# Altium project MedBox.PrjPcb
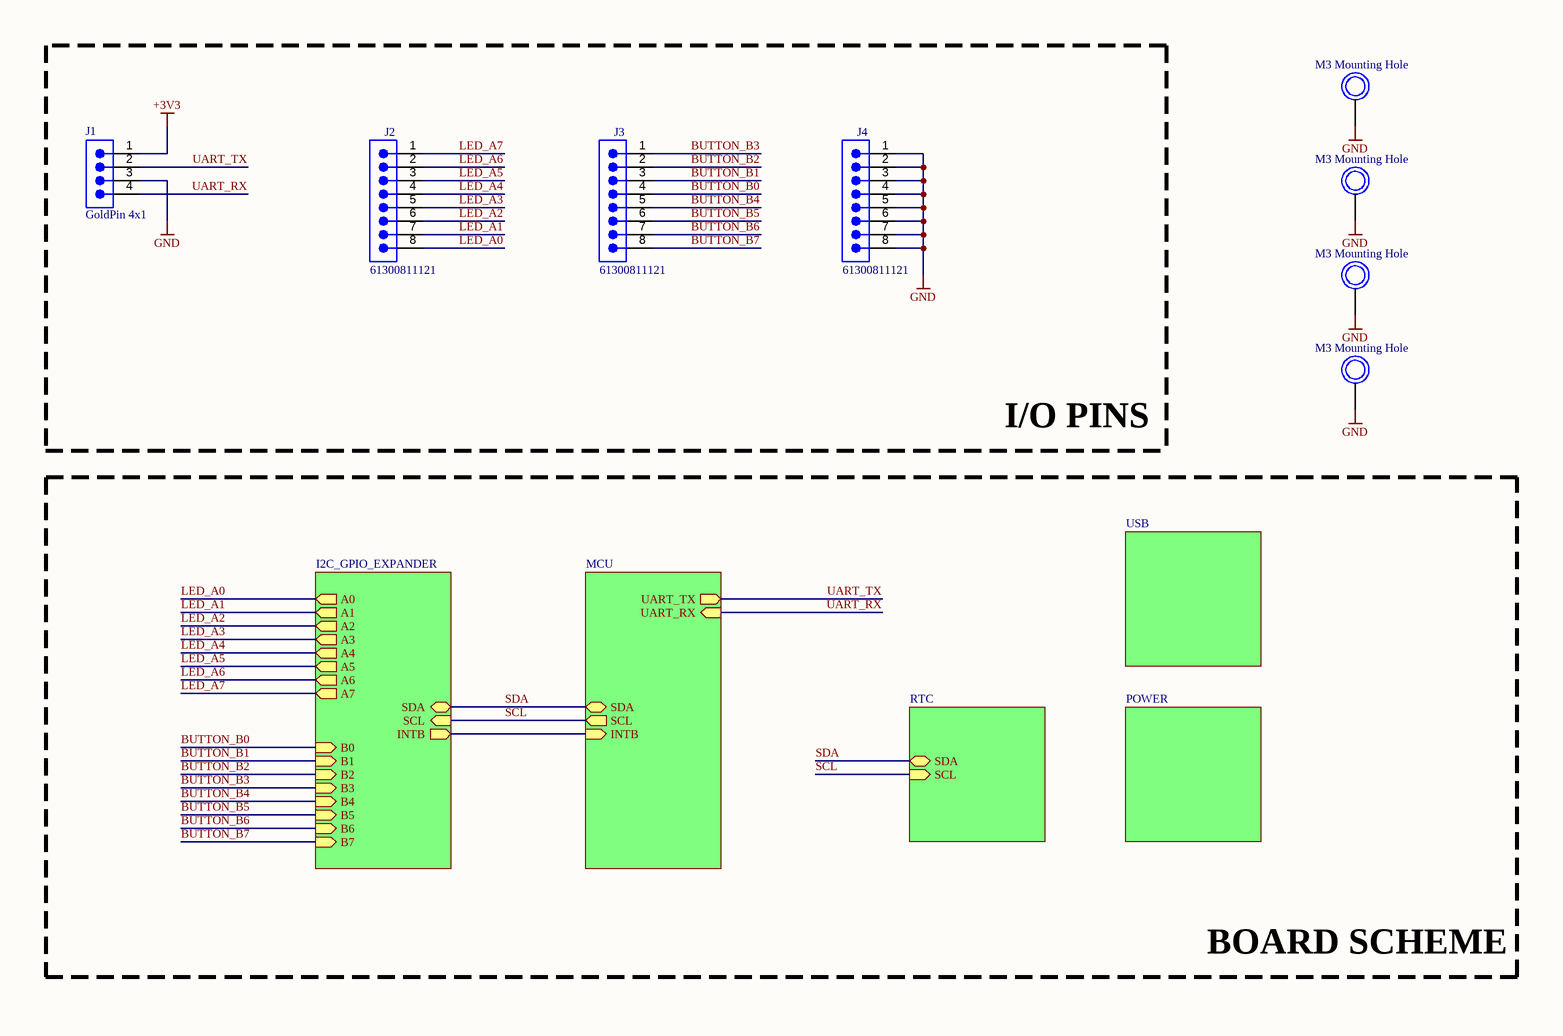
[diagram p0: MED_BOX.SchDoc]
6 sheets, 54 parts. Net scope: hierarchical (ports join the sheet entries above them; power ports are global).
Board files: MED_BOX.PcbDoc, MED_BOX_v0.2.PcbDoc
Sheets:
  MED_BOX.SchDoc
    Designator = MCU.SchDoc
    Designator = I2C_GPIO_EXPANDER.SchDoc
    Designator = POWER.SchDoc
    USB = USB.SchDoc
    RTC = RTC.SchDoc

## Sheet MED_BOX.SchDoc
size A4; SheetNumber: 1; SheetTotal: 6

### Parts
J1  GoldPin 4x1  [SMTC-TSW-104-08-X-S]
J2  61300811121  [61300811121]
J3  61300811121  [61300811121]
J4  61300811121  [61300811121]
MH1  M3 Mounting Hole  [Copy of M4 Mounting Hole]
MH2  M3 Mounting Hole  [Copy of M4 Mounting Hole]
MH3  M3 Mounting Hole  [Copy of M4 Mounting Hole]
MH4  M3 Mounting Hole  [Copy of M4 Mounting Hole]

### Blocks framed on the sheet
I/O PINS: J1-J4

### Sub-sheets
Designator = MCU: SDA (bidir), SCL (out), INTB (in), UART_TX (out), UART_RX (in)
Designator = I2C_GPIO_EXPANDER: A0 (out), A1 (out), A2 (out), A3 (out), A4 (out), A5 (out), A6 (out), A7 (out), B0 (in), B1 (in), B2 (in), B3 (in), B4 (in), B5 (in), B6 (in), B7 (in), SCL (in), SDA (bidir), INTB (out)
Designator = POWER: no entries
RTC = RTC: SDA (bidir), SCL (in)
USB = USB: no entries

### Nets
+3V3: J1.1  [project net VCC]
GND: J1.3 J4.1 J4.2 J4.3 J4.4 J4.5 J4.6 J4.7 J4.8 MH1.1 MH2.1 MH3.1 MH4.1
BUTTON_B0: J3.4 ; sheet Designator/B0
BUTTON_B1: J3.3 ; sheet Designator/B1
BUTTON_B2: J3.2 ; sheet Designator/B2
BUTTON_B3: J3.1 ; sheet Designator/B3
BUTTON_B4: J3.5 ; sheet Designator/B4
BUTTON_B5: J3.6 ; sheet Designator/B5
BUTTON_B6: J3.7 ; sheet Designator/B6
BUTTON_B7: J3.8 ; sheet Designator/B7
LED_A0: J2.8 ; sheet Designator/A0
LED_A1: J2.7 ; sheet Designator/A1
LED_A2: J2.6 ; sheet Designator/A2
LED_A3: J2.5 ; sheet Designator/A3
LED_A4: J2.4 ; sheet Designator/A4
LED_A5: J2.3 ; sheet Designator/A5
LED_A6: J2.2 ; sheet Designator/A6
LED_A7: J2.1 ; sheet Designator/A7
SCL: sheet Designator/SCL, sheet Designator/SCL, sheet RTC/SCL
SDA: sheet Designator/SDA, sheet Designator/SDA, sheet RTC/SDA
UART_RX: J1.4 ; sheet Designator/UART_RX
UART_TX: J1.2 ; sheet Designator/UART_TX
NetU1_20: sheet Designator/INTB, sheet Designator/INTB

### Notes on the sheet
- BOARD SCHEME
- DWG. NO.
- REV.
- SHT.
- REVISION
- DESCRIPTION
- DATE
- APPROVED
- THIS DOCUMENT AND THE DATA DISCLOSED HEREIN OR HEREWITH IS THE PROPERTY OF ALTIUM LIMITED AND MAY BE FREELY DISTRIBUTED IN WHOLE. NO RIGHTS ARE RESERVED OR EXPRESS OR IMPLIED WARANTEE GIVEN.
- ENG:
- DSN:
- APPROVALS
- PROJECT
- DOCUMENT REVISION:
- DESIGN ITEM:
- CHK:
- BOM:
- REFERENCE DOCUMENTS
- PROJECT REVISION:
- TITLE
- FAB DWG:
- PCB DWG:
- ASSY DWG:
- SCALE:
- SIZE
- D
- CAGE CODE
- FILE NAME
- DWG NO.
- SHEET
- OF
- REV

### Library data of the parts
J1 = CMP-00067-4: TSW - Samtec 2.54mm Pin Header 13.46mm Overall Pin Length 5.08mm Tail (08) (mcv)(TO22); Manufacturer: Molex
J2-J4 = CMP-1502-01076-4: THT Vertical Pin Header WR-PHD, Pitch 2.54 mm, Single Row, 8 pins; Pitch: 2.54mm; Voltage Rating: 250V; Connector Type: Male Pin; Current Rating: 3A; Contact Resistance: 20mΩ; Number of Positions: 8; Gender: Male; Contact Mating Length: 5.9944mm; Orientation: Vertical; Contact Plating: Gold; Mount: Through Hole; Min Operating Temperature: -40°C; Packaging: Bulk; Height: 8.54mm; Number of Pins: 8; Contact Material: Gold; Operating Supply Voltage: 250V; Termination: Solder; RoHS: Compliant; Color: Black; Number of Contacts: 8; Lead Pitch: 2.54mm; Number of Rows: 1; Max Operating Temperature: 105°C
MH1-MH4 = CONN-00002-1: Manufacturer: Molex

## Sheet MCU.SchDoc
size A4; SheetNumber: 5; SheetTotal: 6
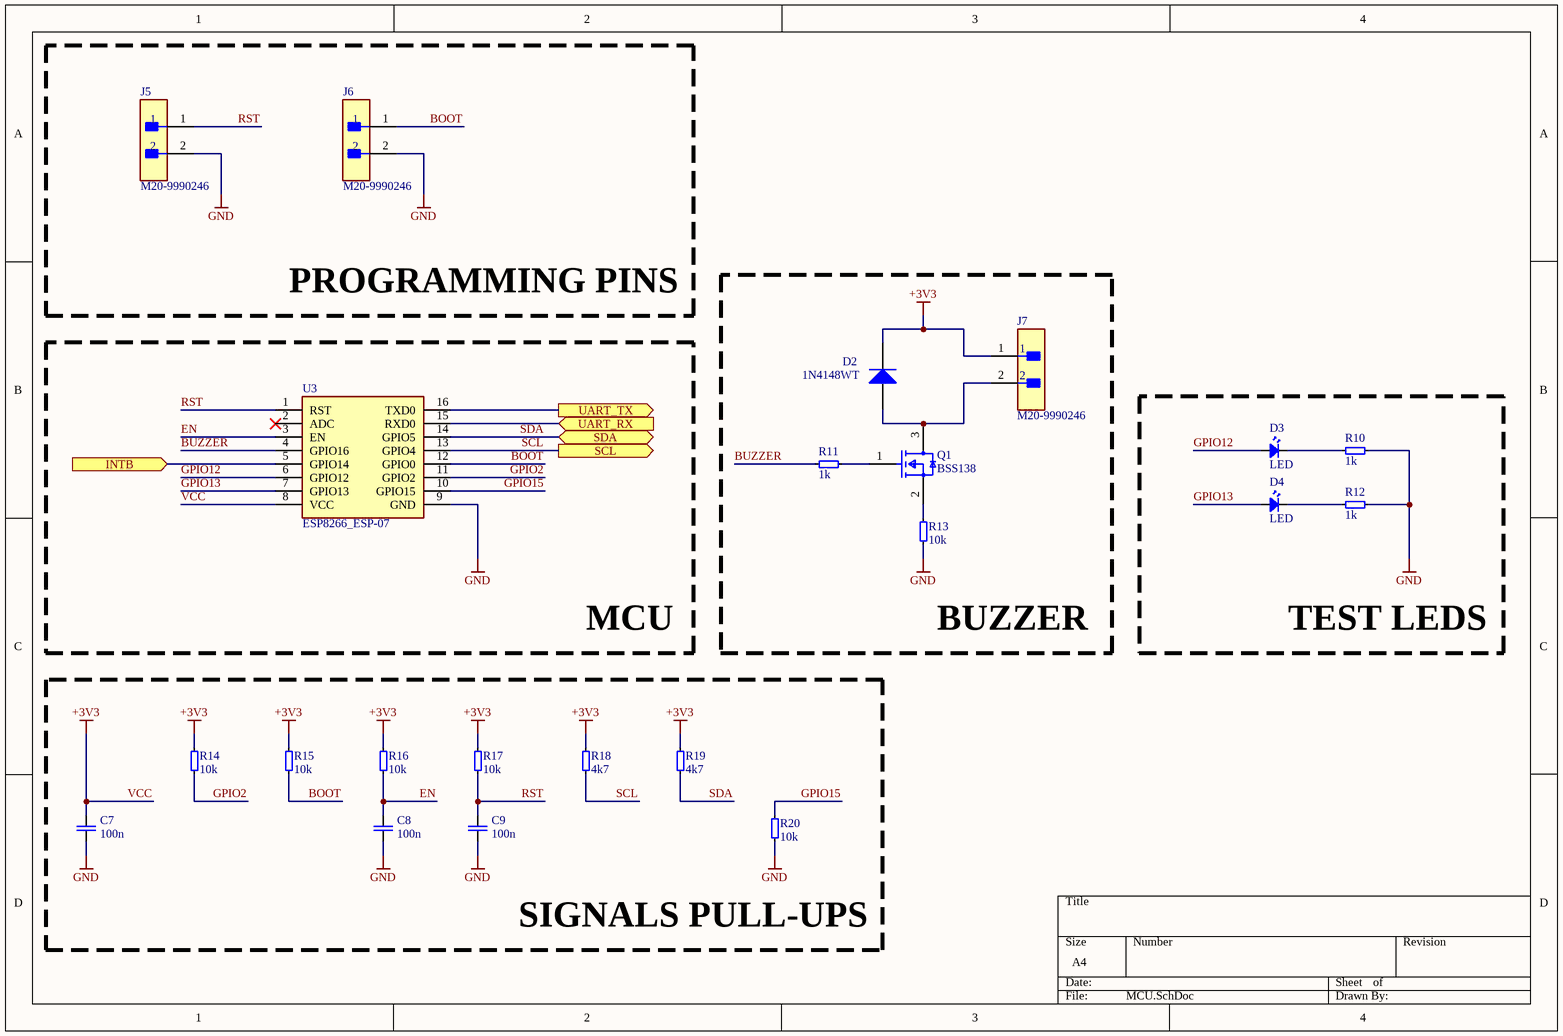
[diagram p1: MCU.SchDoc]

### Parts
C7  100n  [C0603]
C8  100n  [C0603]
C9  100n  [C0603]
D2  1N4148WT  [FAIR-SOD-523F-2_V]
D3  LED  [LED0603]
D4  LED  [LED0603]
J5  M20-9990246  [FP-M20-9990246-MFG]
J6  M20-9990246  [FP-M20-9990246-MFG]
J7  M20-9990246  [FP-M20-9990246-MFG]
Q1  BSS138  [FP-318-08-IPC_B]
R10  1k  [R0603]
R11  1k  [R0603]
R12  1k  [R0603]
R13  10k  [R0603]
R14  10k  [R0603]
R15  10k  [R0603]
R16  10k  [R0603]
R17  10k  [R0603]
R18  4k7  [R0603]
R19  4k7  [R0603]
R20  10k  [R0603]
U3  ESP8266_ESP-07  [ESP8266ESP07]

### Blocks framed on the sheet
PROGRAMMING PINS: J5 J6
BUZZER: D2 J7 Q1 R11 R13
MCU: U3
TEST LEDS: D3 D4 R10 R12
SIGNALS PULL-UPS: C7-C9 R14-R20

### Ports
INTB (in, see MED_BOX[3B], I2C_GPIO_EXPANDER[1A]), SCL (out, see MED_BOX[3B], I2C_GPIO_EXPANDER[1B], RTC[1A]), SDA (bidir, see MED_BOX[3B], I2C_GPIO_EXPANDER[1B], RTC[1A]), UART_RX (in, see MED_BOX[2B]), UART_TX (out, see MED_BOX[2B])

### Nets
GND: C7.1 C8.1 C9.1 J5.2 J6.2 R10.2 R12.2 R13.1 R20.1 U3.9(GND)
VCC: C7.2 D2.1(K) J7.1 R14.2 R15.2 R16.2 R17.2 R18.2 R19.2 U3.8(VCC)  [also labelled +3V3]
BOOT: J6.1 R15.1 U3.12(GPIO0)
BUZZER: R11.2 U3.4(GPIO16)
EN: C8.2 R16.1 U3.3(EN)
GPIO2: R14.1 U3.11(GPIO2)
GPIO12: D3.A U3.6(GPIO12)
GPIO13: D4.A U3.7(GPIO13)
GPIO15: R20.2 U3.10(GPIO15)
RST: C9.2 J5.1 R17.1 U3.1(RST)
SCL: R18.1 U3.13(GPIO4) ; port SCL
SDA: R19.1 U3.14(GPIO5) ; port SDA
UART_RX: U3.15(RXD0) ; port UART_RX
UART_TX: U3.16(TXD0) ; port UART_TX
NetD2_2: D2.2(A) J7.2 Q1.3(D)
NetD3_K: D3.K R10.1
NetD4_K: D4.K R12.1
NetQ1_1: Q1.1(G) R11.1
NetQ1_2: Q1.2(S) R13.2
NetU1_20: U3.5(GPIO14) ; port INTB

Not connected (* = marked no-connect by the designer): U3 2(ADC)*

### Library data of the parts
C7-C9 = CMP-00024-8: Generic 0603 SMD Ceramic Capacitor
D2 = CMP-0881-00001-1: High Conductance Fast Switching Diode, 75 V, -55 to 150 degC, 2-Pin SOD523F, RoHS; Manufacturer: Fairchild Semiconductor; IR (VR: 75 V)=5 uA Max.; VF: 1 V Max.; BVR (IR: 5 uA)=75 V Min.; CO: 4 pF Max.; DatasheetVersion: Rev. A2; ComponentLink1Description: Manufacturer URL; PackageDescription: 2-Pin Surface Mount Device, Body 1.2 x 0.8 mm, Height 0.7 mm; ComponentLink2URL: http://www.fairchildsemi.com/ds/1N/1N4148WT.pdf; ComponentLink2Description: Datasheet; PartNumber: 1N4148WT; ComponentLink1URL: http://www.fairchildsemi.com/; Temperature Range: -55 to 150 degC; Mounting Technology: Surface Mount; PackageReference: SOD-523F-2; RoHS: TRUE
D3 D4 = CMP-00036-7: 0603 LED
J5-J7 = CMP-15831-000009-1: CONN HEADER VERT 2POS 2.54MM; Manufacturer: Harwin; Conn Gender: Male; Conn Orientation: Vertical; Number Of Contacts: 2; Current Rating: 3A; ComponentLink2URL: https://cdn.harwin.com/pdfs/M20-999.pdf; ComponentLink2Description: Datasheet; Package: M20-9990246; Temperature: -40°C to +105°C; Octopart: https://octopart.com/m20-9990246-harwin-2590635; Mouser Description: 2.54mm (0.1") Pitch SIL Vertical PC Tail Pin Header, 6.1mm mating pin height, tin, 2 contacts; Temperature Range High: +105°C; Device Class L1: Connectors; RoHS: TRUE; Automotive: No; Height: 8.99mm; Number Of Rows: 1; Contact Material: Tin,Nickel; Category: Conn; Pitch: 2.54mm; Lead Free: Yes; Digikey Description: CONN HEADER VERT 2POS 2.54MM; Manufacturer Part Number: M20-9990246; Temperature Range Low: -40°C; Device Class L3: unset; Device Class L2: Headers and Wire Housings
Q1 = CMP-07173-000101-1: MOSFET N-CH 50V 220MA SOT-23; Turn-Off Delay Time: 20ns; Element Configuration: Single; Rds On Max: 3.5R; Gate to Source Voltage (Vgs): 20V; Threshold Voltage: 1.3V; Number of Elements: 1; Power Dissipation: 360mW; Rise Time: 9ns; Turn-On Delay Time: 2.5ns; Input Capacitance: 27pF; On-State Resistance: 6R; Lead Free: Lead Free; Length: 2.92mm; Width: 1.3mm; Drain to Source Breakdown Voltage: 50V; Min Operating Temperature: -55°C; REACH SVHC: No SVHC; Packaging: Tape and Reel; Radiation Hardening: No; Height: 0.93mm; Drain to Source Voltage (Vdss): 50V; Current Rating: 220mA; Voltage Rating (DC): 50V; Weight: 0.03g; Continuous Drain Current (ID): 220mA; Number of Pins: 3; Nominal Vgs: 1.3V; Max Power Dissipation: 360mW; Fall Time: 9ns; Drain to Source Resistance: 3.5R; Contact Plating: Tin; Case/Package: SOT-23; Package Quantity: 1; Dual Supply Voltage: 50V; Mount: Surface Mount; Termination: SMD/SMT; Max Operating Temperature: 150°C
R10-R20 = CMP-00017-10: Generic 0603 SMD Resistor
U3 = ESP8266_ESP-07: Connector; Manufacturer_Name: Ai-Thinker; Manufacturer_Part_Number: ESP8266 ESP-07; Datasheet Link: http://datasheet.octopart.com/ESP-07S-RF-Solutions-datasheet-104506015.pdf; Height: 3mm

## Sheet I2C_GPIO_EXPANDER.SchDoc
size A4; SheetNumber: 2; SheetTotal: 6
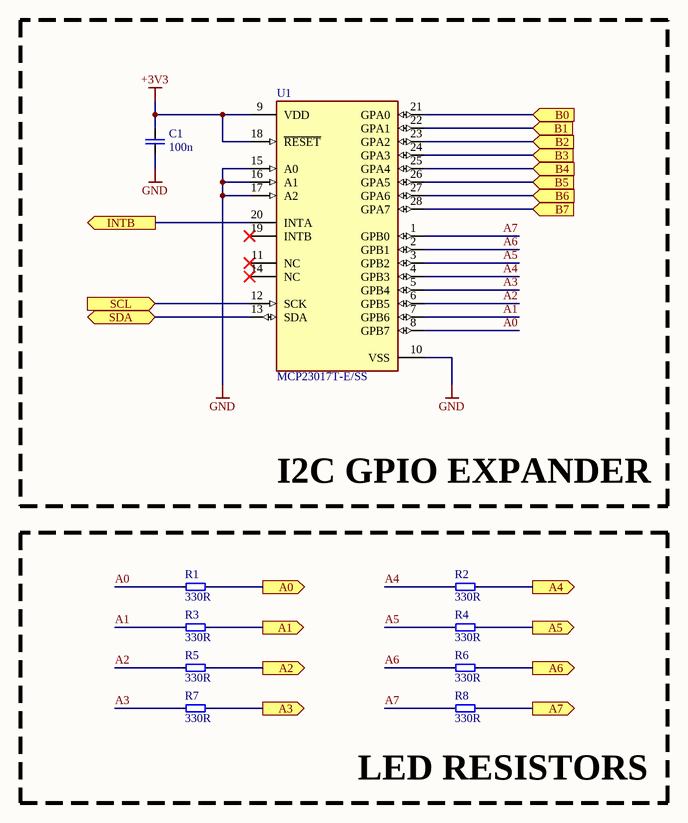
[diagram p2: I2C_GPIO_EXPANDER.SchDoc]

### Parts
C1  100n  [C0603]
R1  330R  [R0603]
R2  330R  [R0603]
R3  330R  [R0603]
R4  330R  [R0603]
R5  330R  [R0603]
R6  330R  [R0603]
R7  330R  [R0603]
R8  330R  [R0603]
U1  MCP23017T-E/SS  [FP-C04-073-IPC_C]

### Blocks framed on the sheet
I2C GPIO EXPANDER: C1 U1
LED RESISTORS: R1-R8

### Ports
A0 (out, see MED_BOX[3B]), A1 (out, see MED_BOX[3B]), A2 (out, see MED_BOX[3B]), A3 (out, see MED_BOX[3B]), A4 (out, see MED_BOX[3B]), A5 (out, see MED_BOX[3B]), A6 (out, see MED_BOX[3B]), A7 (out, see MED_BOX[3B]), B0 (in, see MED_BOX[3B]), B1 (in, see MED_BOX[3B]), B2 (in, see MED_BOX[3B]), B3 (in, see MED_BOX[3A]), B4 (in, see MED_BOX[3A]), B5 (in, see MED_BOX[3A]), B6 (in, see MED_BOX[3A]), B7 (in, see MED_BOX[3A]), INTB (out, see MED_BOX[3B], MCU[1B]), SCL (in, see MED_BOX[3B], MCU[2B], RTC[1A]), SDA (bidir, see MED_BOX[3B], MCU[2B], RTC[1A])

### Nets
+3V3: C1.2 U1.9(VDD) U1.18(~{RESET})  [project net VCC]
GND: C1.1 U1.10(VSS) U1.15(A0) U1.16(A1) U1.17(A2)
A0: R1.1 U1.8(GPB7)
A1: R3.1 U1.7(GPB6)
A2: R5.1 U1.6(GPB5)
A3: R7.1 U1.5(GPB4)
A4: R2.1 U1.4(GPB3)
A5: R4.1 U1.3(GPB2)
A6: R6.1 U1.2(GPB1)
A7: R8.1 U1.1(GPB0)
BUTTON_B0: U1.21(GPA0) ; port B0
BUTTON_B1: U1.22(GPA1) ; port B1
BUTTON_B2: U1.23(GPA2) ; port B2
BUTTON_B3: U1.24(GPA3) ; port B3
BUTTON_B4: U1.25(GPA4) ; port B4
BUTTON_B5: U1.26(GPA5) ; port B5
BUTTON_B6: U1.27(GPA6) ; port B6
BUTTON_B7: U1.28(GPA7) ; port B7
LED_A0: R1.2 ; port A0
LED_A1: R3.2 ; port A1
LED_A2: R5.2 ; port A2
LED_A3: R7.2 ; port A3
LED_A4: R2.2 ; port A4
LED_A5: R4.2 ; port A5
LED_A6: R6.2 ; port A6
LED_A7: R8.2 ; port A7
SCL: U1.12(SCK) ; port SCL
SDA: U1.13(SDA) ; port SDA
NetU1_20: U1.20(INTA) ; port INTB

Not connected (* = marked no-connect by the designer): U1 11(NC)* 14(NC)* 19(INTB)*

### Library data of the parts
C1 = CMP-00024-8: Generic 0603 SMD Ceramic Capacitor
R1-R8 = CMP-00017-10: Generic 0603 SMD Resistor
U1 = CMP-0186-00065-3: IC I/O EXPANDER 16BIT I2C 28SSOP; Number of Channels: 1; Number of Bits: 16; Output Current: 25mA; Nominal Supply Current: 1mA; Operating Supply Voltage: 5.5V; Power Dissipation: 700mW; Max Frequency: 10MHz; Frequency: 1.7MHz; Case/Package: SSOP; Lead Free: Lead Free; Number of Pins: 28; Interface: I2C; Max Operating Temperature: 125°C; Mount: Surface Mount; Number of I/Os: 16; Packaging: Tape and Reel; Min Operating Temperature: -40°C; Package Quantity: 2100

## Sheet POWER.SchDoc
size A4; SheetNumber: 4; SheetTotal: 6
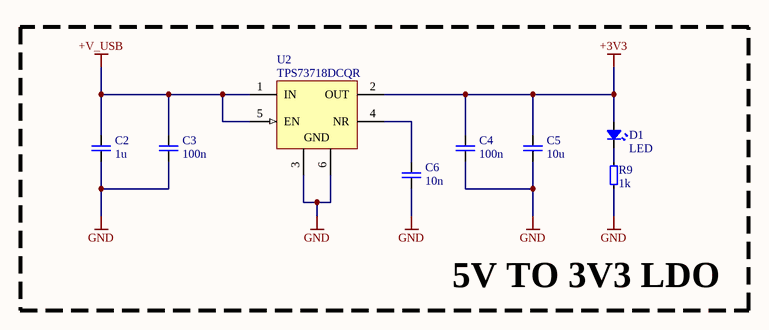
[diagram p3: POWER.SchDoc]

### Parts
C2  1u  [C0603]
C3  100n  [C0603]
C4  100n  [C0603]
C5  10u  [C0805]
C6  10n  [C0603]
D1  LED  [LED0603]
R9  1k  [R0603]
U2  TPS73718DCQR  [DCQ0006A_L]

### Blocks framed on the sheet
5V TO 3V3 LDO: C2-C6 D1 R9 U2

### Nets
+3V3: C4.2 C5.2 D1.A U2.2(OUT)  [project net VCC]
+V_USB: C2.2 C3.2 U2.1(IN) U2.5(EN)
GND: C2.1 C3.1 C4.1 C5.1 C6.1 R9.1 U2.3(GND) U2.6(GND)
NetC6_2: C6.2 U2.4(NR)
NetD1_K: D1.K R9.2

### Library data of the parts
C2-C4 C6 = CMP-00024-8: Generic 0603 SMD Ceramic Capacitor
C5 = CMP-00025-5: Generic 0805 SMD Ceramic Capacitor
D1 = CMP-00036-7: 0603 LED
R9 = CMP-00017-10: Generic 0603 SMD Resistor
U2 = CMP-0395-00291-2: Single Output LDO, 1 A, Fixed 1.8 V Output, 2.2 to 5.5 V Input, with Reverse Current Protection, 6-pin SOT-223 (DCQ), -40 to 125 degC, Green (RoHS & no Sb/Br); Manufacturer: Texas Instruments; Vout Adj(Max)(V): 1.8; Iout(Max)(A): 1; Vin(Max)(V): 5.5; Vdo(Typ)(mV): 130; Rating: Catalog; SubFamily: Single Channel LDO; Vin(Min)(V): 2.2; Accuracy(%): 3; Iq(Typ)(mA): 0.3; DatasheetVersion: SBVS067O; ComponentLink3Description: Package Specification; PackageReference: DCQ0006A; ComponentLink2Description: Datasheet; PackageDescription: 6-Pin Plastic Small Outline, Body 3.5 x 6.5 mm, Pitch 1.27 mm; Mounting Technology: Surface Mount; ComponentLink3URL: http://www.ti.com/litv/pdf/mpds098c; PartNumber: TPS73718DCQR; Fixed Output Options(V): 1.8; ComponentLink1URL: http://www.ti.com/; PackageVersion: 4202109/D; ComponentLink2URL: http://www.ti.com/general/docs/lit/getliterature.tsp?genericPartNumber=TPS73718&fileType=pdf; Eco-Plan: Green (RoHS & no Sb/Br); ComponentLink1Description: Manufacturer URL; Vout Adj(Min)(V): 1.8

## Sheet USB.SchDoc
size A4; SheetNumber: 3; SheetTotal: 6
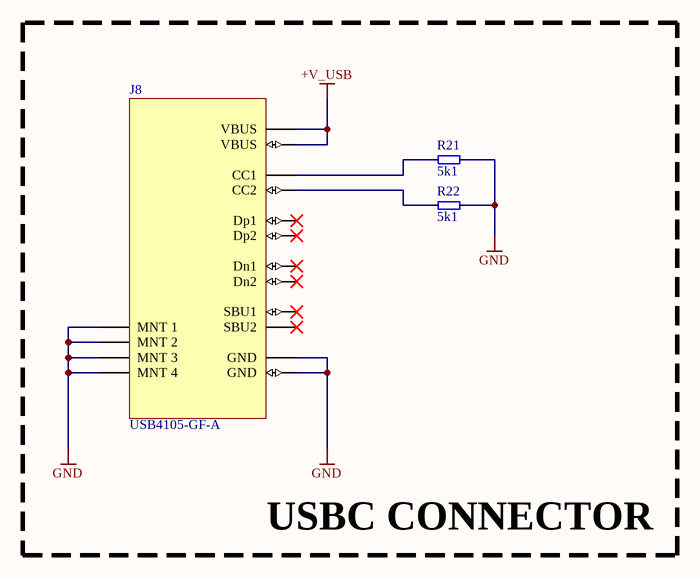
[diagram p4: USB.SchDoc]

### Parts
J8  USB4105-GF-A  [FP-USB4105-GF-A-MFG]
R21  5k1  [R0402]
R22  5k1  [R0402]

### Blocks framed on the sheet
USBC CONNECTOR: J8 R21 R22

### Nets
+V_USB: J8.A4-B9(VBUS) J8.B4-A9(VBUS)
GND: J8.1(MNT_1) J8.2(MNT_2) J8.3(MNT_3) J8.4(MNT_4) J8.A1-B12(GND) J8.B1-A12(GND) R21.2 R22.2
NetJ8_A5: J8.A5(CC1) R21.1
NetJ8_B5: J8.B5(CC2) R22.1

Not connected (* = marked no-connect by the designer): J8 A6(Dp1)* A7(Dn1)* A8(SBU1)* B6(Dp2)* B7(Dn2)* B8(SBU2)*

### Library data of the parts
J8 = CONN-00045-1: USB Connector, 24 Contact(s), Female, Right Angle, Solder Terminal, Locking, Receptacle; Manufacturer: GCT; Supplier: Mouser; Manufacturer PN: USB4105-GF-A; Supplier PN: 640-USB4105-GF-A
R21 R22 = CMP-00016-10: Generic 0402 SMD Resistor

## Sheet RTC.SchDoc
size A4; SheetNumber: 6; SheetTotal: 6
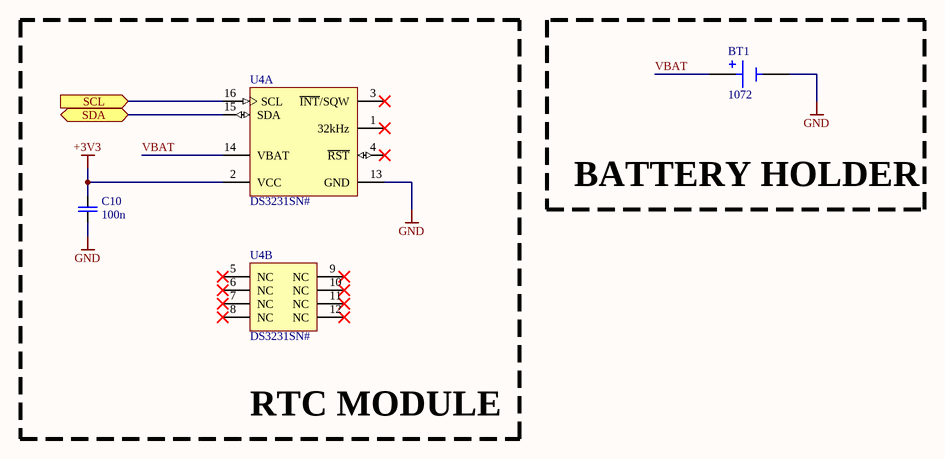
[diagram p5: RTC.SchDoc]

### Parts
BT1  1072  [BAT_1072]
C10  100n  [C0603]
U4  DS3231SN#  [W16#H2_L]  (parts A,B of 2)

### Blocks framed on the sheet
RTC MODULE: C10 U4
BATTERY HOLDER: BT1

### Ports
SCL (in, see MED_BOX[2B], I2C_GPIO_EXPANDER[1B], MCU[2B]), SDA (bidir, see MED_BOX[2B], I2C_GPIO_EXPANDER[1B], MCU[2B])

### Nets
+3V3: C10.2 U4.2(VCC)  [project net VCC]
GND: BT1.N(NEG) C10.1 U4.13(GND)
SCL: U4.16(SCL) ; port SCL
SDA: U4.15(SDA) ; port SDA
VBAT: BT1.P(POS) U4.14(VBAT)

Not connected (* = marked no-connect by the designer): U4 1(32kHz)* 3(~{INT}/SQW)* 4(~{RST})* 5(NC)* 6(NC)* 7(NC)* 8(NC)* 9(NC)* 10(NC)* 11(NC)* 12(NC)*

### Library data of the parts
BT1 = 1072: Battery Holder CR1220/1225; MF: Keystone Electronics; SnapEDA_Link: https://www.snapeda.com/parts/1072/Keystone/view-part/?ref=snap; Package: NON STANDARD-2 Keystone; Value: *; MP: 1072; Check_prices: https://www.snapeda.com/parts/1072/Keystone/view-part/?ref=eda
C10 = CMP-00024-8: Generic 0603 SMD Ceramic Capacitor
U4 = CMP-0254-00293-2: Extremely Accurate I2C-Integrated Real-Time Clock/TCXO/Crystal, 16-Pin SO, -40 to 85 degC, RoHS Qualified; Code_IPC: SOIC127P1030-16; ComponentLink2URL: http://datasheets.maxim-ic.com/en/ds/DS3231.pdf; Code_JEDEC: MS-013-AA; ComponentLink1URL: http://www.maxim-ic.com; ComponentLink2Description: Datasheet; ComponentLink3Description: Package Specification; DatasheetVersion: Rev 8, Jul-2010; PackageVersion: revD, 2010; ComponentLink1Description: Manufacturer URL; PackageDescription: 16-Pin Small-Outline IC, Wide (0.3in), 1.27 mm Pitch, SOIC (W), RoHS Qualified; ComponentLink3URL: http://pdfserv.maxim-ic.com/package_dwgs/21-0042.PDF; PackageReference: W16#H2

## Nets that join several sheets
+V_USB: POWER (C2.2 C3.2 U2.1 U2.5), USB (J8.A4-B9 J8.B4-A9)
GND: MED_BOX (13 pins), MCU (10 pins), I2C_GPIO_EXPANDER (5 pins), POWER (8 pins), USB (8 pins), RTC (BT1.N C10.1 U4.13)
VCC: MED_BOX (J1.1), MCU (10 pins), I2C_GPIO_EXPANDER (C1.2 U1.9 U1.18), POWER (C4.2 C5.2 D1.A U2.2), RTC (C10.2 U4.2)
BUTTON_B0: MED_BOX (J3.4), I2C_GPIO_EXPANDER (U1.21)
BUTTON_B1: MED_BOX (J3.3), I2C_GPIO_EXPANDER (U1.22)
BUTTON_B2: MED_BOX (J3.2), I2C_GPIO_EXPANDER (U1.23)
BUTTON_B3: MED_BOX (J3.1), I2C_GPIO_EXPANDER (U1.24)
BUTTON_B4: MED_BOX (J3.5), I2C_GPIO_EXPANDER (U1.25)
BUTTON_B5: MED_BOX (J3.6), I2C_GPIO_EXPANDER (U1.26)
BUTTON_B6: MED_BOX (J3.7), I2C_GPIO_EXPANDER (U1.27)
BUTTON_B7: MED_BOX (J3.8), I2C_GPIO_EXPANDER (U1.28)
LED_A0: MED_BOX (J2.8), I2C_GPIO_EXPANDER (R1.2)
LED_A1: MED_BOX (J2.7), I2C_GPIO_EXPANDER (R3.2)
LED_A2: MED_BOX (J2.6), I2C_GPIO_EXPANDER (R5.2)
LED_A3: MED_BOX (J2.5), I2C_GPIO_EXPANDER (R7.2)
LED_A4: MED_BOX (J2.4), I2C_GPIO_EXPANDER (R2.2)
LED_A5: MED_BOX (J2.3), I2C_GPIO_EXPANDER (R4.2)
LED_A6: MED_BOX (J2.2), I2C_GPIO_EXPANDER (R6.2)
LED_A7: MED_BOX (J2.1), I2C_GPIO_EXPANDER (R8.2)
NetU1_20: MCU (U3.5), I2C_GPIO_EXPANDER (U1.20)
SCL: MCU (R18.1 U3.13), I2C_GPIO_EXPANDER (U1.12), RTC (U4.16)
SDA: MCU (R19.1 U3.14), I2C_GPIO_EXPANDER (U1.13), RTC (U4.15)
UART_RX: MED_BOX (J1.4), MCU (U3.15)
UART_TX: MED_BOX (J1.2), MCU (U3.16)